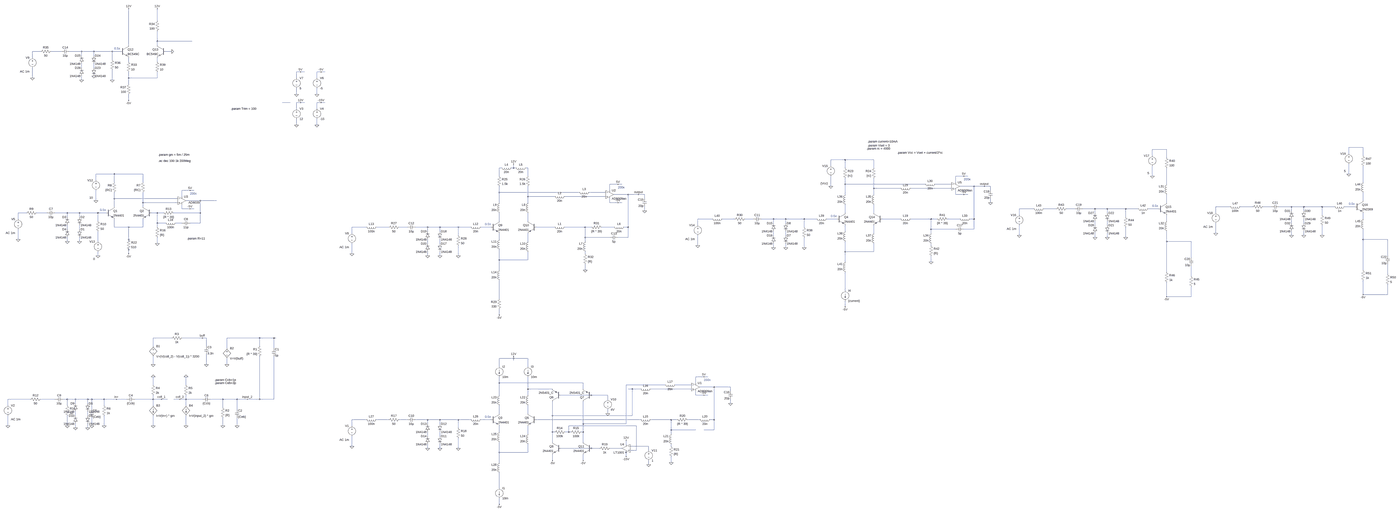
[diagram p0: schematic 202_bandwidth_sim.asc, whole sheet]
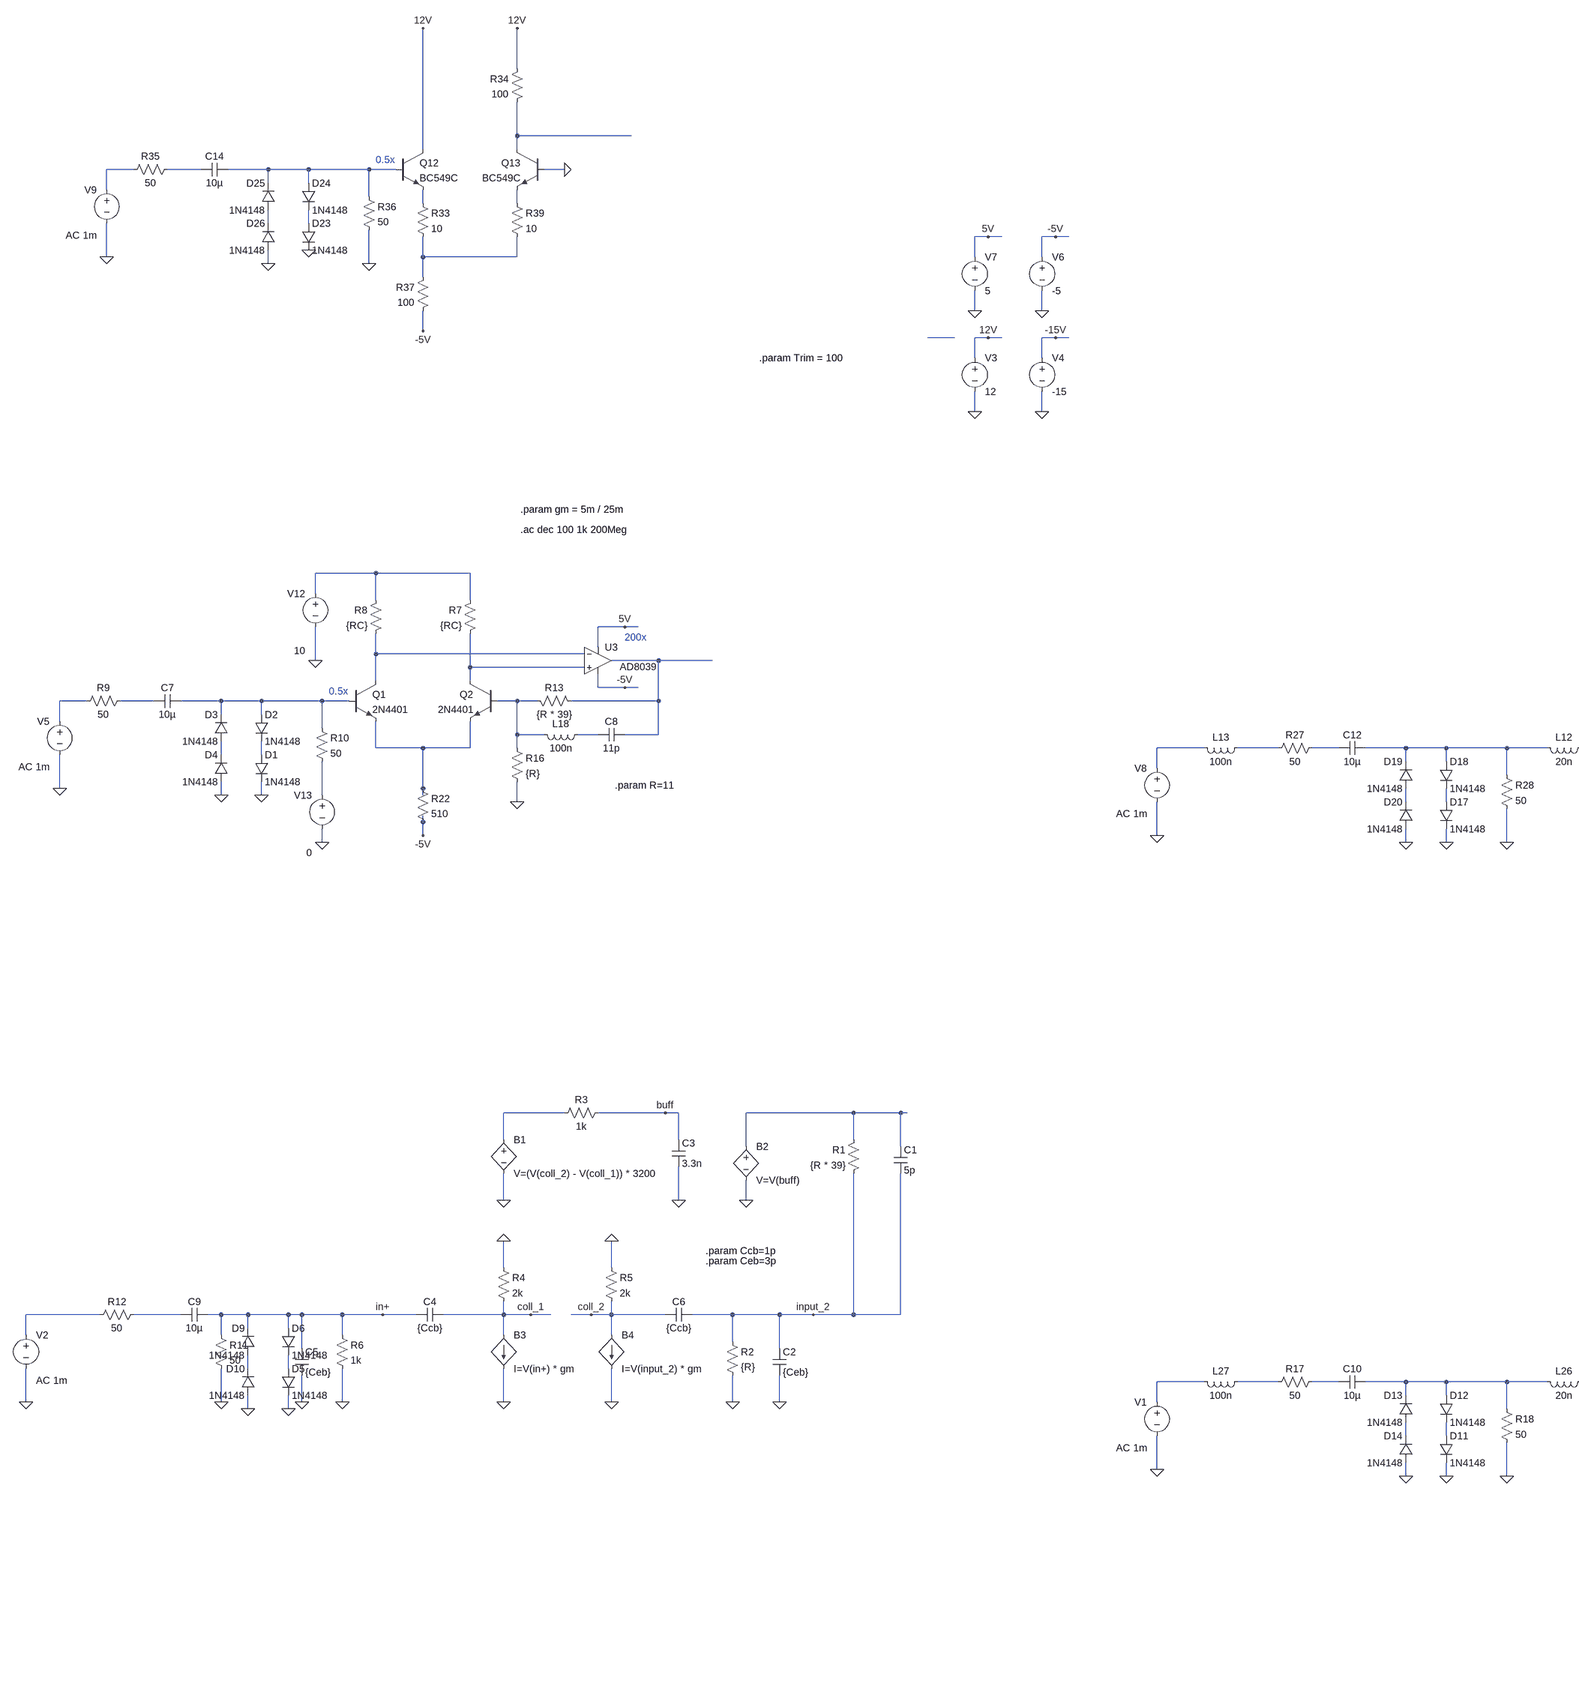
[diagram p1: schematic 202_bandwidth_sim.asc, part, row 1 of 1, column 1 of 3]
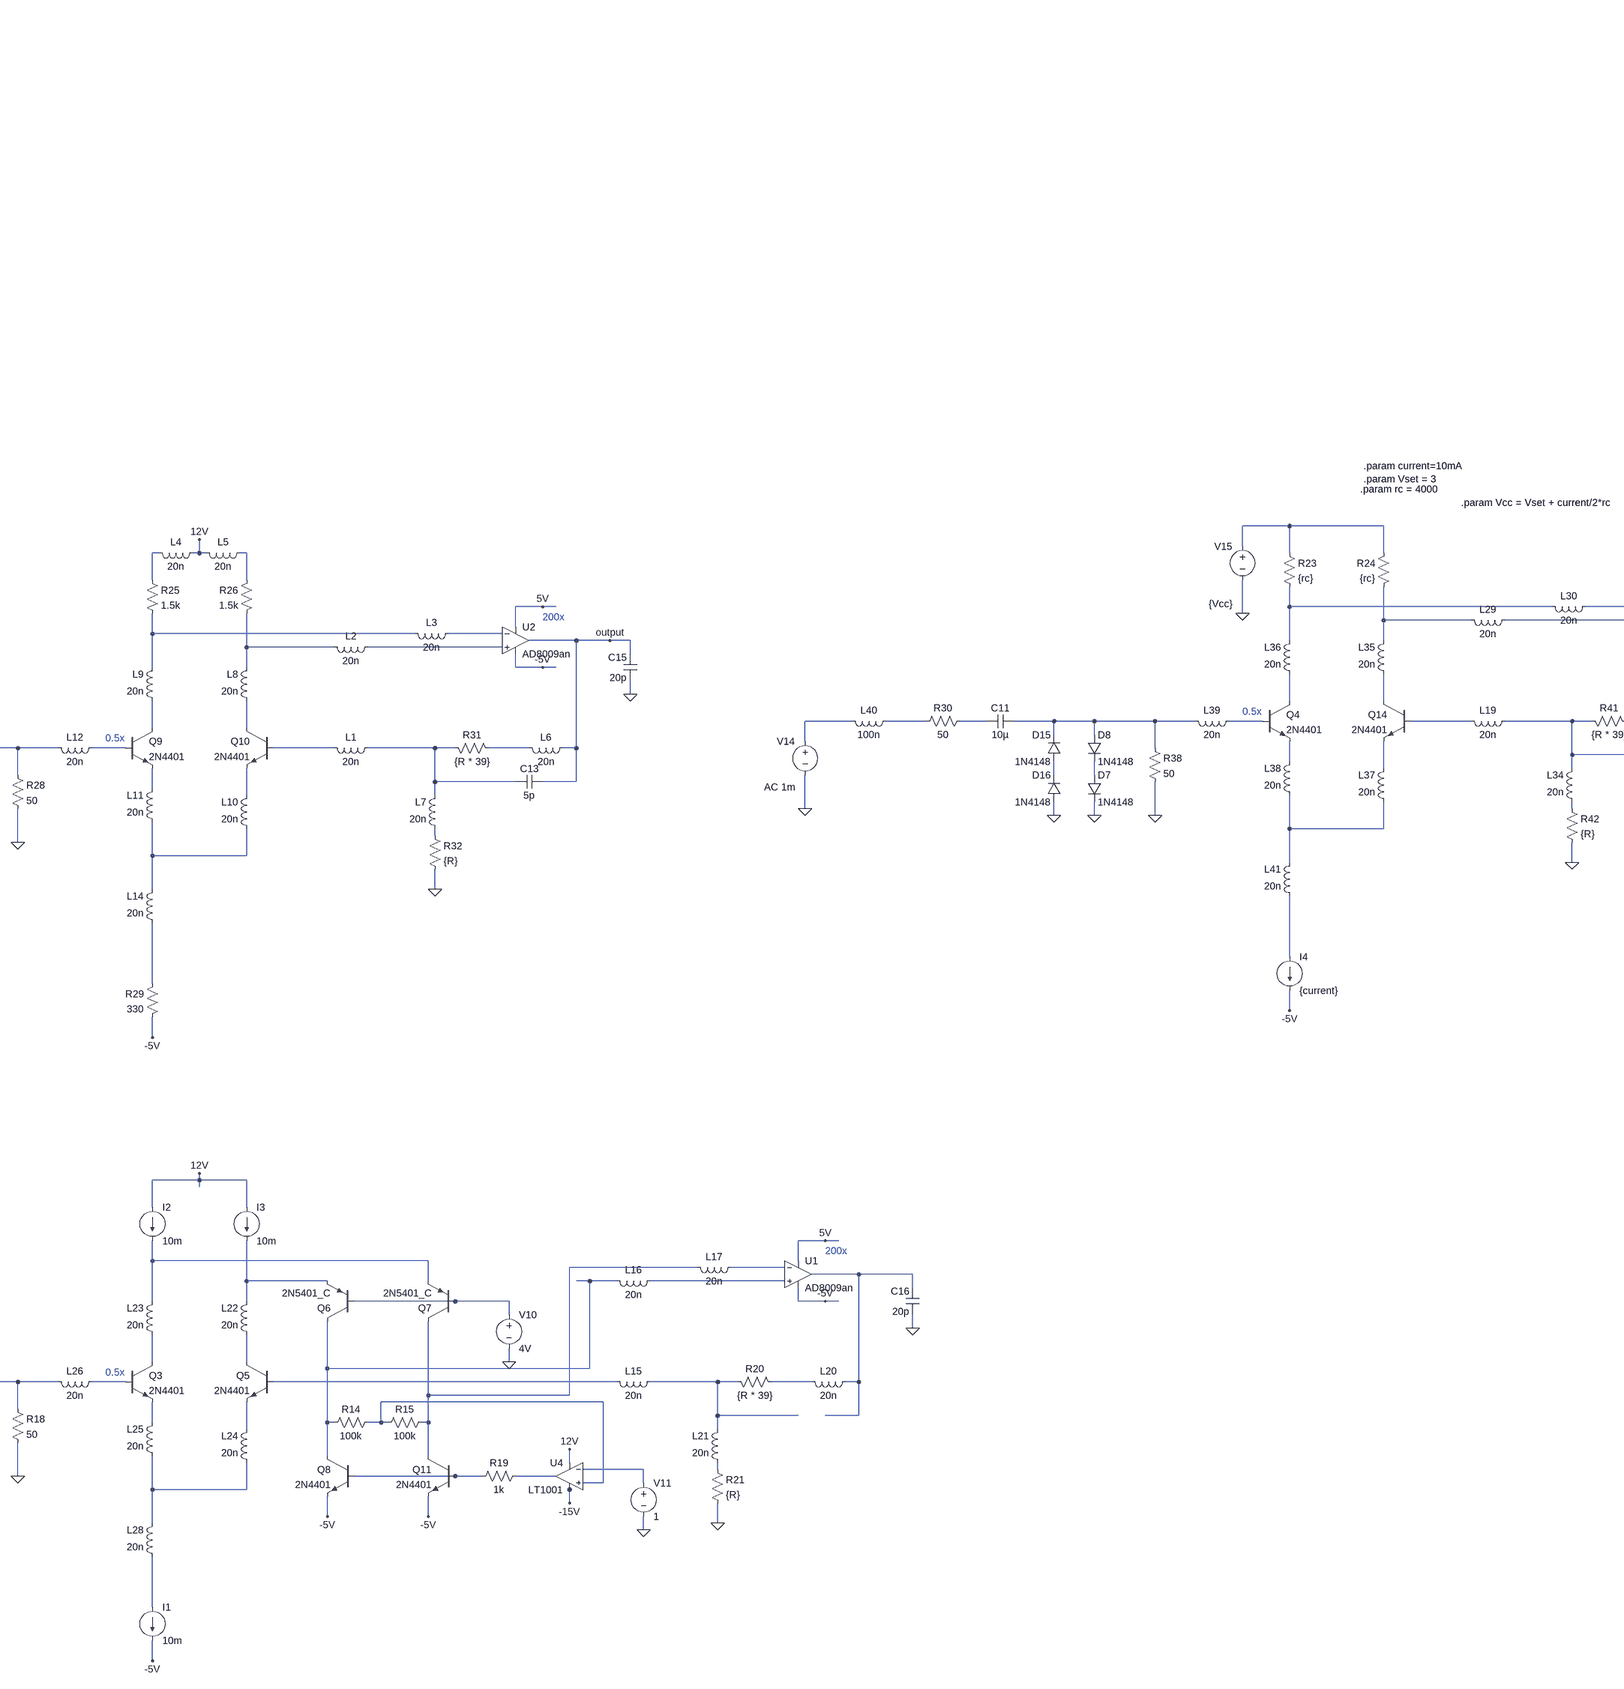
[diagram p2: schematic 202_bandwidth_sim.asc, part, row 1 of 1, column 2 of 3]
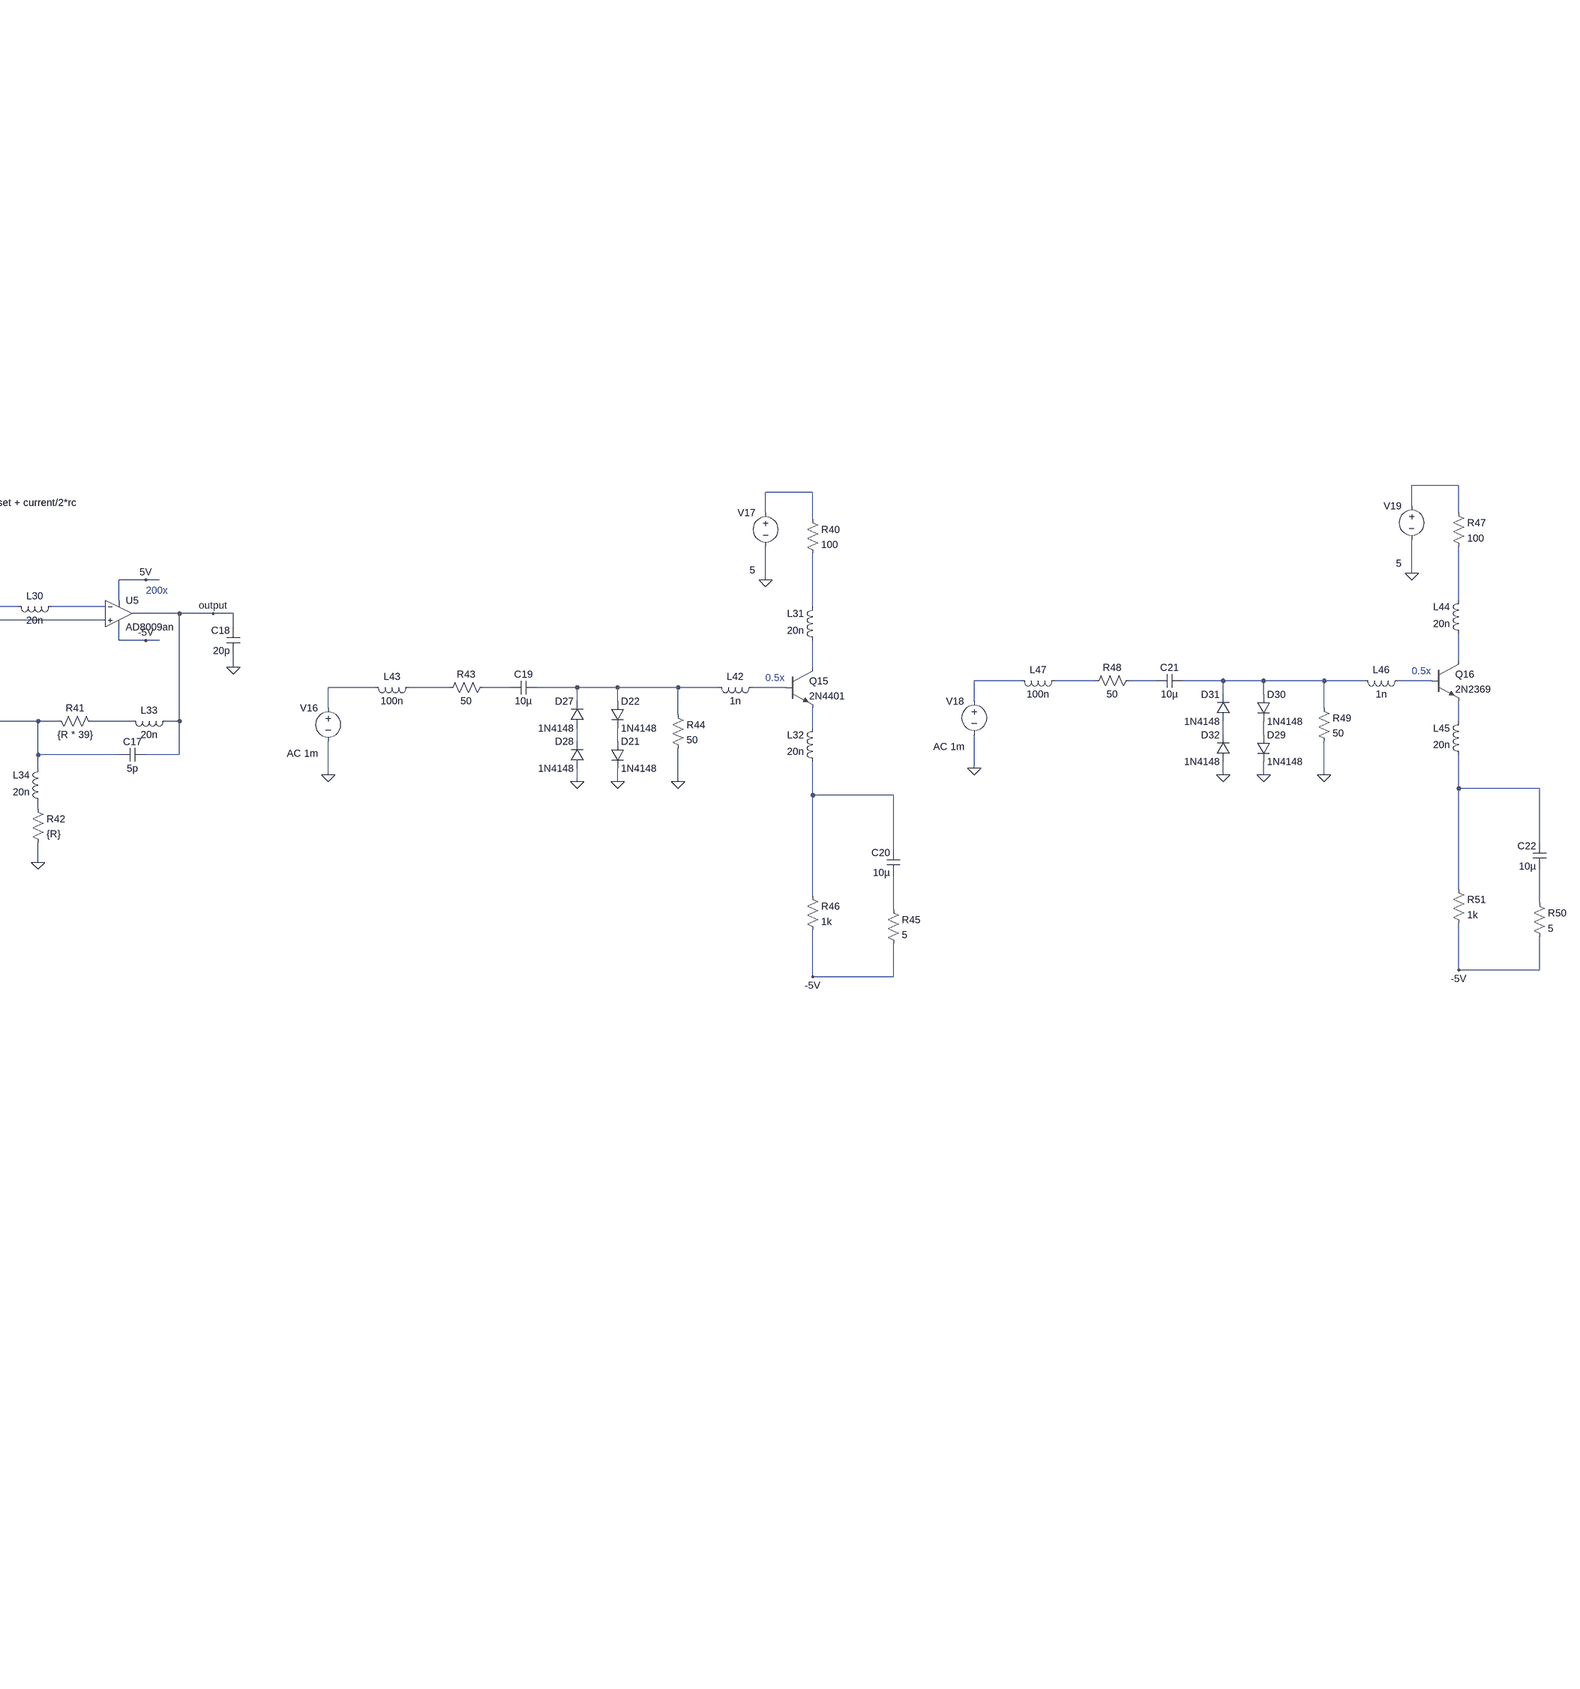
[diagram p3: schematic 202_bandwidth_sim.asc, part, row 1 of 1, column 3 of 3]
202_bandwidth_sim.asc, the LTspice schematic file:
Version 4
SHEET 1 5092 2452
WIRE -6144 -1472 -6144 -1568
WIRE -6144 -1312 -6144 -1392
WIRE -5872 -1312 -6144 -1312
WIRE -6368 -1280 -6368 -1568
WIRE -6144 -1280 -6144 -1312
WIRE -7056 -1232 -7120 -1232
WIRE -6896 -1232 -6976 -1232
WIRE -6736 -1232 -6832 -1232
WIRE -6640 -1232 -6736 -1232
WIRE -6496 -1232 -6640 -1232
WIRE -6432 -1232 -6496 -1232
WIRE -6032 -1232 -6080 -1232
WIRE -6736 -1200 -6736 -1232
WIRE -6640 -1200 -6640 -1232
WIRE -7120 -1184 -7120 -1232
WIRE -6496 -1168 -6496 -1232
WIRE -6368 -1152 -6368 -1184
WIRE -6144 -1152 -6144 -1184
WIRE -6736 -1104 -6736 -1136
WIRE -6640 -1104 -6640 -1136
WIRE -5024 -1072 -5056 -1072
WIRE -4992 -1072 -5024 -1072
WIRE -4864 -1072 -4896 -1072
WIRE -4832 -1072 -4864 -1072
WIRE -7120 -1024 -7120 -1104
WIRE -6368 -1024 -6368 -1072
WIRE -6144 -1024 -6144 -1072
WIRE -6144 -1024 -6368 -1024
WIRE -5056 -1024 -5056 -1072
WIRE -4896 -1024 -4896 -1072
WIRE -6736 -1008 -6736 -1040
WIRE -6496 -1008 -6496 -1088
WIRE -6368 -976 -6368 -1024
WIRE -5056 -896 -5056 -944
WIRE -4896 -896 -4896 -944
WIRE -6368 -848 -6368 -896
WIRE -5104 -832 -5168 -832
WIRE -5024 -832 -5056 -832
WIRE -4992 -832 -5024 -832
WIRE -4864 -832 -4896 -832
WIRE -4832 -832 -4864 -832
WIRE -5056 -784 -5056 -832
WIRE -4896 -784 -4896 -832
WIRE -5056 -656 -5056 -704
WIRE -4896 -656 -4896 -704
WIRE 4832 -480 4720 -480
WIRE 3296 -464 3184 -464
WIRE 4720 -432 4720 -480
WIRE 3184 -416 3184 -464
WIRE 4832 -416 4832 -480
WIRE 3296 -400 3296 -464
WIRE 656 -384 544 -384
WIRE 880 -384 656 -384
WIRE 544 -336 544 -384
WIRE -2032 -320 -2048 -320
WIRE -1936 -320 -1936 -352
WIRE -1936 -320 -1952 -320
WIRE -1920 -320 -1936 -320
WIRE -1824 -320 -1840 -320
WIRE 656 -320 656 -384
WIRE 880 -320 880 -384
WIRE -6480 -272 -6624 -272
WIRE -6256 -272 -6480 -272
WIRE 4720 -272 4720 -352
WIRE -2048 -256 -2048 -320
WIRE -1824 -256 -1824 -320
WIRE 1584 -256 1520 -256
WIRE 1616 -256 1584 -256
WIRE 3184 -256 3184 -336
WIRE -6624 -224 -6624 -272
WIRE -6480 -208 -6480 -272
WIRE -6256 -208 -6256 -272
WIRE 1520 -208 1520 -256
WIRE 4832 -208 4832 -336
WIRE -1120 -192 -1184 -192
WIRE -1088 -192 -1120 -192
WIRE 656 -192 656 -240
WIRE 1280 -192 656 -192
WIRE 1488 -192 1360 -192
WIRE 3296 -192 3296 -320
WIRE 544 -176 544 -256
WIRE 1664 -176 1552 -176
WIRE 1744 -176 1664 -176
WIRE 1792 -176 1744 -176
WIRE 880 -160 880 -240
WIRE 1088 -160 880 -160
WIRE 1488 -160 1168 -160
WIRE -5888 -144 -5952 -144
WIRE -5856 -144 -5888 -144
WIRE -1184 -144 -1184 -192
WIRE 1792 -144 1792 -176
WIRE -2048 -128 -2048 -176
WIRE -1424 -128 -2048 -128
WIRE -1216 -128 -1344 -128
WIRE -1040 -112 -1152 -112
WIRE -960 -112 -1040 -112
WIRE -912 -112 -960 -112
WIRE 656 -112 656 -192
WIRE 880 -112 880 -160
WIRE 1520 -112 1520 -144
WIRE 1584 -112 1520 -112
WIRE 1616 -112 1584 -112
WIRE -5952 -96 -5952 -144
WIRE -1824 -96 -1824 -176
WIRE -1616 -96 -1824 -96
WIRE -1216 -96 -1536 -96
WIRE -6480 -80 -6480 -128
WIRE -5984 -80 -6480 -80
WIRE -912 -80 -912 -112
WIRE -6624 -64 -6624 -144
WIRE -5808 -64 -5920 -64
WIRE -5680 -64 -5808 -64
WIRE 4832 -64 4832 -128
WIRE -6256 -48 -6256 -128
WIRE -5984 -48 -6256 -48
WIRE -2048 -48 -2048 -128
WIRE -1824 -48 -1824 -96
WIRE -1184 -48 -1184 -80
WIRE -1120 -48 -1184 -48
WIRE -1088 -48 -1120 -48
WIRE 1792 -48 1792 -80
WIRE 3296 -48 3296 -112
WIRE -6480 -16 -6480 -80
WIRE -6256 -16 -6256 -48
WIRE 3792 -16 3680 -16
WIRE 3968 -16 3872 -16
WIRE 4112 -16 4048 -16
WIRE 4272 -16 4176 -16
WIRE 4368 -16 4272 -16
WIRE 4512 -16 4368 -16
WIRE 4608 -16 4512 -16
WIRE 4768 -16 4688 -16
WIRE -5952 0 -5952 -32
WIRE -5888 0 -5952 0
WIRE -5856 0 -5888 0
WIRE 2256 0 2144 0
WIRE 2432 0 2336 0
WIRE 2576 0 2512 0
WIRE 2736 0 2640 0
WIRE 2832 0 2736 0
WIRE 2976 0 2832 0
WIRE 3072 0 2976 0
WIRE 3232 0 3152 0
WIRE -912 16 -912 -16
WIRE 4272 16 4272 -16
WIRE 4368 16 4368 -16
WIRE -7168 32 -7232 32
WIRE -7008 32 -7088 32
WIRE -6848 32 -6944 32
WIRE -6752 32 -6848 32
WIRE -6608 32 -6752 32
WIRE -6544 32 -6608 32
WIRE -6144 32 -6192 32
WIRE -6096 32 -6144 32
WIRE -5808 32 -5808 -64
WIRE -5808 32 -6016 32
WIRE 656 32 656 -32
WIRE 880 32 880 -32
WIRE 2736 32 2736 0
WIRE 2832 32 2832 0
WIRE 3680 32 3680 -16
WIRE 2144 48 2144 0
WIRE 4512 48 4512 -16
WIRE -6848 64 -6848 32
WIRE -6752 64 -6752 32
WIRE 2976 64 2976 0
WIRE -7232 80 -7232 32
WIRE -384 80 -496 80
WIRE -208 80 -304 80
WIRE -64 80 -128 80
WIRE 96 80 0 80
WIRE 192 80 96 80
WIRE 336 80 192 80
WIRE 432 80 336 80
WIRE 592 80 512 80
WIRE 1088 80 944 80
WIRE 1328 80 1168 80
WIRE 1376 80 1328 80
WIRE 1552 80 1456 80
WIRE 1664 80 1664 -176
WIRE 1664 80 1632 80
WIRE 4832 80 4832 32
WIRE -6608 96 -6608 32
WIRE -2048 96 -2048 32
WIRE -1824 96 -1824 32
WIRE 3296 96 3296 48
WIRE -6144 112 -6144 32
WIRE -6080 112 -6144 112
WIRE -5952 112 -6000 112
WIRE -5808 112 -5808 32
WIRE -5808 112 -5888 112
WIRE 96 112 96 80
WIRE 192 112 192 80
WIRE 4272 112 4272 80
WIRE 4368 112 4368 80
WIRE -496 128 -496 80
WIRE 2736 128 2736 96
WIRE 2832 128 2832 96
WIRE -6480 144 -6480 80
WIRE -6368 144 -6480 144
WIRE -6256 144 -6256 80
WIRE -6256 144 -6368 144
WIRE -6144 144 -6144 112
WIRE -3088 144 -3200 144
WIRE -2912 144 -3008 144
WIRE -2768 144 -2832 144
WIRE -2608 144 -2704 144
WIRE -2512 144 -2608 144
WIRE -2368 144 -2512 144
WIRE -2272 144 -2368 144
WIRE -2112 144 -2192 144
WIRE -1616 144 -1760 144
WIRE -1376 144 -1536 144
WIRE -1328 144 -1376 144
WIRE -1152 144 -1248 144
WIRE -1040 144 -1040 -112
WIRE -1040 144 -1072 144
WIRE 336 144 336 80
WIRE -6848 160 -6848 128
WIRE -6752 160 -6752 128
WIRE 1328 160 1328 80
WIRE 1520 160 1328 160
WIRE 1664 160 1664 80
WIRE 1664 160 1584 160
WIRE -2608 176 -2608 144
WIRE -2512 176 -2512 144
WIRE 656 176 656 128
WIRE -3200 192 -3200 144
WIRE 880 192 880 128
WIRE 1328 192 1328 160
WIRE 3680 192 3680 112
WIRE -2368 208 -2368 144
WIRE 96 208 96 176
WIRE 192 208 192 176
WIRE 2144 208 2144 128
WIRE 4272 208 4272 176
WIRE 4368 208 4368 176
WIRE 4512 208 4512 128
WIRE -1376 224 -1376 144
WIRE -1184 224 -1376 224
WIRE -1040 224 -1040 144
WIRE -1040 224 -1120 224
WIRE 2736 224 2736 192
WIRE 2832 224 2832 192
WIRE 2976 224 2976 144
WIRE -7232 240 -7232 160
WIRE -6368 240 -6368 144
WIRE -2048 240 -2048 192
WIRE 4832 240 4832 160
WIRE 5024 240 4832 240
WIRE -6848 256 -6848 224
WIRE -6752 256 -6752 224
WIRE -6608 256 -6608 176
WIRE -6368 256 -6368 240
WIRE -1824 256 -1824 192
WIRE -1376 256 -1376 224
WIRE 3296 256 3296 176
WIRE 3488 256 3296 256
WIRE -6144 272 -6144 224
WIRE -2608 272 -2608 240
WIRE -2512 272 -2512 240
WIRE -496 288 -496 208
WIRE 1328 288 1328 272
WIRE 96 304 96 272
WIRE 192 304 192 272
WIRE 336 304 336 224
WIRE -6368 320 -6368 304
WIRE 656 336 656 256
WIRE 880 336 880 272
WIRE 880 336 656 336
WIRE -6368 352 -6368 320
WIRE -3200 352 -3200 272
WIRE -1376 352 -1376 336
WIRE -6608 368 -6608 336
WIRE -2608 368 -2608 336
WIRE -2512 368 -2512 336
WIRE -2368 368 -2368 288
WIRE 5024 368 5024 240
WIRE 3488 384 3488 256
WIRE -2048 400 -2048 320
WIRE -1824 400 -1824 336
WIRE -1824 400 -2048 400
WIRE 656 416 656 336
WIRE 1328 416 1328 368
WIRE -2048 480 -2048 400
WIRE -1376 480 -1376 432
WIRE 4832 480 4832 240
WIRE 3296 496 3296 256
WIRE 5024 512 5024 432
WIRE 3488 528 3488 448
WIRE 656 640 656 496
WIRE 4832 672 4832 560
WIRE 5024 672 5024 592
WIRE 5024 672 4832 672
WIRE 3296 688 3296 576
WIRE 3488 688 3488 608
WIRE 3488 688 3296 688
WIRE -2048 704 -2048 560
WIRE 656 768 656 720
WIRE -2048 832 -2048 784
WIRE -6032 1040 -6176 1040
WIRE -5792 1040 -5952 1040
WIRE -5760 1040 -5792 1040
WIRE -5344 1040 -5600 1040
WIRE -5232 1040 -5344 1040
WIRE -5216 1040 -5232 1040
WIRE -6176 1104 -6176 1040
WIRE -5760 1104 -5760 1040
WIRE -5344 1104 -5344 1040
WIRE -5600 1120 -5600 1040
WIRE -5232 1120 -5232 1040
WIRE -1936 1200 -1936 1184
WIRE -1936 1200 -2048 1200
WIRE -1824 1200 -1936 1200
WIRE -1936 1216 -1936 1200
WIRE -6176 1248 -6176 1184
WIRE -6176 1248 -6192 1248
WIRE -5760 1248 -5760 1168
WIRE -5600 1248 -5600 1200
WIRE -5600 1248 -5616 1248
WIRE -2048 1264 -2048 1200
WIRE -1824 1264 -1824 1200
WIRE -448 1344 -512 1344
WIRE -416 1344 -448 1344
WIRE -2048 1392 -2048 1344
WIRE -1392 1392 -2048 1392
WIRE -512 1392 -512 1344
WIRE -6176 1408 -6176 1344
WIRE -5920 1408 -5920 1344
WIRE -752 1408 -1056 1408
WIRE -544 1408 -672 1408
WIRE -368 1424 -480 1424
WIRE -240 1424 -368 1424
WIRE -1824 1440 -1824 1344
WIRE -1632 1440 -1824 1440
WIRE -1392 1440 -1392 1392
WIRE -1008 1440 -1040 1440
WIRE -944 1440 -1008 1440
WIRE -544 1440 -864 1440
WIRE -240 1456 -240 1424
WIRE -2048 1488 -2048 1392
WIRE -1824 1488 -1824 1440
WIRE -1328 1488 -1568 1488
WIRE -1200 1488 -1328 1488
WIRE -512 1488 -512 1456
WIRE -448 1488 -512 1488
WIRE -416 1488 -448 1488
WIRE -7136 1520 -7312 1520
WIRE -6944 1520 -7056 1520
WIRE -6848 1520 -6880 1520
WIRE -6784 1520 -6848 1520
WIRE -6688 1520 -6784 1520
WIRE -6656 1520 -6688 1520
WIRE -6560 1520 -6656 1520
WIRE -6464 1520 -6560 1520
WIRE -6384 1520 -6464 1520
WIRE -6176 1520 -6176 1488
WIRE -6176 1520 -6320 1520
WIRE -6112 1520 -6176 1520
WIRE -6064 1520 -6112 1520
WIRE -5968 1520 -6016 1520
WIRE -5920 1520 -5920 1488
WIRE -5920 1520 -5968 1520
WIRE -5792 1520 -5920 1520
WIRE -5632 1520 -5728 1520
WIRE -5520 1520 -5632 1520
WIRE -5440 1520 -5520 1520
WIRE -5344 1520 -5344 1184
WIRE -5344 1520 -5440 1520
WIRE -5232 1520 -5232 1184
WIRE -5232 1520 -5344 1520
WIRE -1200 1520 -1200 1488
WIRE -6784 1552 -6784 1520
WIRE -6688 1552 -6688 1520
WIRE -240 1552 -240 1520
WIRE -7312 1568 -7312 1520
WIRE -6848 1568 -6848 1520
WIRE -6560 1568 -6560 1520
WIRE -6176 1568 -6176 1520
WIRE -5920 1568 -5920 1520
WIRE -5632 1584 -5632 1520
WIRE -6656 1600 -6656 1520
WIRE -5520 1600 -5520 1520
WIRE -2048 1632 -2048 1568
WIRE -1824 1632 -1824 1568
WIRE -1200 1632 -1200 1600
WIRE -6784 1648 -6784 1616
WIRE -6688 1648 -6688 1616
WIRE -1632 1648 -1632 1536
WIRE -1008 1648 -1008 1440
WIRE -1008 1648 -1632 1648
WIRE -3088 1680 -3200 1680
WIRE -2912 1680 -3008 1680
WIRE -2768 1680 -2832 1680
WIRE -2608 1680 -2704 1680
WIRE -2512 1680 -2608 1680
WIRE -2368 1680 -2512 1680
WIRE -2272 1680 -2368 1680
WIRE -2112 1680 -2192 1680
WIRE -944 1680 -1760 1680
WIRE -704 1680 -864 1680
WIRE -656 1680 -704 1680
WIRE -480 1680 -576 1680
WIRE -368 1680 -368 1424
WIRE -368 1680 -400 1680
WIRE -2608 1712 -2608 1680
WIRE -2512 1712 -2512 1680
WIRE -1392 1712 -1392 1536
WIRE -1056 1712 -1056 1408
WIRE -1056 1712 -1392 1712
WIRE -7312 1728 -7312 1648
WIRE -6848 1728 -6848 1648
WIRE -6656 1728 -6656 1664
WIRE -6560 1728 -6560 1648
WIRE -6176 1728 -6176 1648
WIRE -5920 1728 -5920 1648
WIRE -5632 1728 -5632 1664
WIRE -5520 1728 -5520 1664
WIRE -3200 1728 -3200 1680
WIRE -976 1728 -1504 1728
WIRE -6784 1744 -6784 1712
WIRE -6688 1744 -6688 1712
WIRE -2368 1744 -2368 1680
WIRE -704 1760 -704 1680
WIRE -512 1760 -704 1760
WIRE -368 1760 -368 1680
WIRE -368 1760 -448 1760
WIRE -2048 1776 -2048 1728
WIRE -1632 1776 -1632 1648
WIRE -1616 1776 -1632 1776
WIRE -1504 1776 -1504 1728
WIRE -1504 1776 -1536 1776
WIRE -1488 1776 -1504 1776
WIRE -1392 1776 -1392 1712
WIRE -1392 1776 -1408 1776
WIRE -1824 1792 -1824 1728
WIRE -704 1792 -704 1760
WIRE -2608 1808 -2608 1776
WIRE -2512 1808 -2512 1776
WIRE -1632 1856 -1632 1776
WIRE -1392 1856 -1392 1776
WIRE -1056 1872 -1056 1840
WIRE -3200 1888 -3200 1808
WIRE -880 1888 -1024 1888
WIRE -704 1888 -704 1872
WIRE -2608 1904 -2608 1872
WIRE -2512 1904 -2512 1872
WIRE -2368 1904 -2368 1824
WIRE -1328 1904 -1568 1904
WIRE -1264 1904 -1328 1904
WIRE -1088 1904 -1184 1904
WIRE -976 1920 -976 1728
WIRE -976 1920 -1024 1920
WIRE -880 1920 -880 1888
WIRE -2048 1936 -2048 1856
WIRE -1824 1936 -1824 1872
WIRE -1824 1936 -2048 1936
WIRE -1056 1936 -1056 1920
WIRE -1056 1968 -1056 1936
WIRE -1632 2000 -1632 1952
WIRE -1392 2000 -1392 1952
WIRE -2048 2016 -2048 1936
WIRE -704 2016 -704 1968
WIRE -880 2032 -880 2000
WIRE -2048 2240 -2048 2096
WIRE -2048 2368 -2048 2320
FLAG -5632 1728 0
FLAG -5520 1728 0
FLAG -6176 1248 0
FLAG -5760 1248 0
FLAG -5600 1248 0
FLAG -5792 1040 buff
FLAG -5440 1520 input_2
FLAG -6176 1728 0
FLAG -6176 1344 0
FLAG -7312 1728 0
FLAG -6464 1520 in+
FLAG -5920 1728 0
FLAG -5920 1344 0
FLAG -5968 1520 coll_2
FLAG -6112 1520 coll_1
FLAG -6656 1728 0
FLAG -6560 1728 0
FLAG -5024 -832 12V
FLAG -4864 -832 -15V
FLAG -4896 -656 0
FLAG -5056 -656 0
FLAG -6608 368 0
FLAG -5024 -1072 5V
FLAG -4864 -1072 -5V
FLAG -4896 -896 0
FLAG -5056 -896 0
FLAG -5888 -144 5V
FLAG -5888 0 -5V
FLAG -7232 240 0
FLAG -6752 256 0
FLAG -6848 256 0
FLAG -6144 272 0
FLAG -6368 352 -5V
FLAG -6848 1728 0
FLAG -6688 1744 0
FLAG -6784 1744 0
FLAG -1936 -352 12V
FLAG -2368 368 0
FLAG -1120 -192 5V
FLAG -1120 -48 -5V
FLAG -3200 352 0
FLAG -2512 368 0
FLAG -2608 368 0
FLAG -1376 480 0
FLAG -2048 832 -5V
FLAG -912 16 0
FLAG -6144 -1568 12V
FLAG -7120 -1024 0
FLAG -6736 -1008 0
FLAG -6368 -848 -5V
FLAG -6032 -1232 0
FLAG -960 -112 output
FLAG -1936 1184 12V
FLAG -2368 1904 0
FLAG -448 1344 5V
FLAG -448 1488 -5V
FLAG -3200 1888 0
FLAG -2512 1904 0
FLAG -2608 1904 0
FLAG -704 2016 0
FLAG -2048 2368 -5V
FLAG -240 1552 0
FLAG -1200 1632 0
FLAG -1632 2000 -5V
FLAG -1392 2000 -5V
FLAG -1056 1968 -15V
FLAG -1056 1840 12V
FLAG -880 2032 0
FLAG -6368 -1568 12V
FLAG -6496 -1008 0
FLAG -6640 -1040 0
FLAG -6624 -64 0
FLAG 336 304 0
FLAG 1584 -256 5V
FLAG 1584 -112 -5V
FLAG -496 288 0
FLAG 192 304 0
FLAG 96 304 0
FLAG 1328 416 0
FLAG 656 768 -5V
FLAG 1792 -48 0
FLAG 1744 -176 output
FLAG 544 -176 0
FLAG 2976 224 0
FLAG 2144 208 0
FLAG 2832 224 0
FLAG 2736 224 0
FLAG 3296 688 -5V
FLAG 3184 -256 0
FLAG 4512 208 0
FLAG 3680 192 0
FLAG 4368 208 0
FLAG 4272 208 0
FLAG 4832 672 -5V
FLAG 4720 -272 0
SYMBOL res -5328 1088 M0
SYMATTR InstName R1
SYMATTR Value {R * 39}
SYMBOL res -5648 1568 R0
SYMATTR InstName R2
SYMATTR Value {R}
SYMBOL cap -5248 1120 R0
SYMATTR InstName C1
SYMATTR Value 5p
SYMBOL cap -5536 1600 R0
SYMATTR InstName C2
SYMATTR Value {Ceb}
SYMBOL bv -6176 1088 R0
SYMATTR InstName B1
SYMATTR Value V=(V(coll_2) - V(coll_1)) * 3200
SYMBOL res -5936 1024 R90
WINDOW 0 0 56 VBottom 2
WINDOW 3 32 56 VTop 2
SYMATTR InstName R3
SYMATTR Value 1k
SYMBOL cap -5776 1104 R0
SYMATTR InstName C3
SYMATTR Value 3.3n
SYMBOL bv -5600 1104 R0
SYMATTR InstName B2
SYMATTR Value V=V(buff)
SYMBOL bi -6176 1568 R0
SYMATTR InstName B3
SYMATTR Value I=V(in+) * gm
SYMBOL res -6192 1392 R0
SYMATTR InstName R4
SYMATTR Value 2k
SYMBOL voltage -7312 1552 R0
WINDOW 123 24 124 Left 2
WINDOW 39 0 0 Left 0
SYMATTR Value2 AC 1m
SYMATTR InstName V2
SYMATTR Value ""
SYMBOL bi -5920 1568 R0
SYMATTR InstName B4
SYMATTR Value I=V(input_2) * gm
SYMBOL res -5936 1392 R0
SYMATTR InstName R5
SYMATTR Value 2k
SYMBOL res -6576 1552 R0
SYMATTR InstName R6
SYMATTR Value 1k
SYMBOL cap -5728 1504 R90
WINDOW 0 0 32 VBottom 2
WINDOW 3 32 32 VTop 2
SYMATTR InstName C6
SYMATTR Value {Ccb}
SYMBOL voltage -5056 -800 R0
WINDOW 123 0 0 Left 0
WINDOW 39 0 0 Left 0
SYMATTR InstName V3
SYMATTR Value 12
SYMBOL voltage -4896 -800 R0
WINDOW 123 0 0 Left 0
WINDOW 39 0 0 Left 0
SYMATTR InstName V4
SYMATTR Value -15
SYMBOL voltage -7232 64 M0
WINDOW 123 24 124 Left 2
WINDOW 39 0 0 Left 0
SYMATTR Value2 AC 1m
SYMATTR InstName V5
SYMATTR Value ""
SYMBOL res -6464 -224 M0
SYMATTR InstName R8
SYMATTR Value {RC}
SYMBOL cap -6944 16 R90
WINDOW 0 0 32 VBottom 2
WINDOW 3 32 32 VTop 2
SYMATTR InstName C7
SYMATTR Value 10µ
SYMBOL res -7072 16 R90
WINDOW 0 0 56 VBottom 2
WINDOW 3 32 56 VTop 2
SYMATTR InstName R9
SYMATTR Value 50
SYMBOL res -6624 80 R0
SYMATTR InstName R10
SYMATTR Value 50
SYMBOL cap -5888 96 R90
WINDOW 0 0 32 VBottom 2
WINDOW 3 32 32 VTop 2
SYMATTR InstName C8
SYMATTR Value 11p
SYMBOL npn -6544 -16 R0
SYMATTR InstName Q1
SYMATTR Value 2N4401
SYMBOL npn -6192 -16 M0
SYMATTR InstName Q2
SYMATTR Value 2N4401
SYMBOL voltage -4896 -1040 R0
WINDOW 123 0 0 Left 0
WINDOW 39 0 0 Left 0
SYMATTR InstName V6
SYMATTR Value -5
SYMBOL voltage -5056 -1040 R0
WINDOW 123 0 0 Left 0
WINDOW 39 0 0 Left 0
SYMATTR InstName V7
SYMATTR Value 5
SYMBOL diode -6768 160 R0
SYMATTR InstName D1
SYMATTR Value 1N4148
SYMBOL diode -6768 64 R0
SYMATTR InstName D2
SYMATTR Value 1N4148
SYMBOL diode -6832 128 R180
WINDOW 0 24 64 Left 2
WINDOW 3 24 0 Left 2
SYMATTR InstName D3
SYMATTR Value 1N4148
SYMBOL diode -6832 224 R180
WINDOW 0 24 64 Left 2
WINDOW 3 24 0 Left 2
SYMATTR InstName D4
SYMATTR Value 1N4148
SYMBOL OpAmps\\AD8039 -5952 -128 R0
WINDOW 3 52 78 Left 2
SYMATTR InstName U3
SYMBOL cap -6880 1504 R90
WINDOW 0 0 32 VBottom 2
WINDOW 3 32 32 VTop 2
SYMATTR InstName C9
SYMATTR Value 10µ
SYMBOL res -6864 1552 R0
SYMATTR InstName R11
SYMATTR Value 50
SYMBOL res -7040 1504 R90
WINDOW 0 0 56 VBottom 2
WINDOW 3 32 56 VTop 2
SYMATTR InstName R12
SYMATTR Value 50
SYMBOL cap -6320 1504 R90
WINDOW 0 0 32 VBottom 2
WINDOW 3 32 32 VTop 2
SYMATTR InstName C4
SYMATTR Value {Ccb}
SYMBOL cap -6672 1600 R0
SYMATTR InstName C5
SYMATTR Value {Ceb}
SYMBOL diode -6704 1648 R0
SYMATTR InstName D5
SYMATTR Value 1N4148
SYMBOL diode -6704 1552 R0
SYMATTR InstName D6
SYMATTR Value 1N4148
SYMBOL diode -6768 1616 R180
WINDOW 0 24 64 Left 2
WINDOW 3 24 0 Left 2
SYMATTR InstName D9
SYMATTR Value 1N4148
SYMBOL diode -6768 1712 R180
WINDOW 0 24 64 Left 2
WINDOW 3 24 0 Left 2
SYMATTR InstName D10
SYMATTR Value 1N4148
SYMBOL res -6000 48 M270
WINDOW 0 32 56 VTop 2
WINDOW 3 0 56 VBottom 2
SYMATTR InstName R13
SYMATTR Value {R * 39}
SYMBOL res -6160 128 R0
SYMATTR InstName R16
SYMATTR Value {R}
SYMBOL voltage -3200 176 M0
WINDOW 123 24 124 Left 2
WINDOW 39 0 0 Left 0
SYMATTR Value2 AC 1m
SYMATTR InstName V8
SYMATTR Value ""
SYMBOL res -2064 -272 R0
SYMATTR InstName R25
SYMATTR Value 1.5k
SYMBOL res -1808 -272 M0
SYMATTR InstName R26
SYMATTR Value 1.5k
SYMBOL cap -2704 128 R90
WINDOW 0 0 32 VBottom 2
WINDOW 3 32 32 VTop 2
SYMATTR InstName C12
SYMATTR Value 10µ
SYMBOL res -2816 128 R90
WINDOW 0 0 56 VBottom 2
WINDOW 3 32 56 VTop 2
SYMATTR InstName R27
SYMATTR Value 50
SYMBOL res -2384 192 R0
SYMATTR InstName R28
SYMATTR Value 50
SYMBOL npn -2112 96 R0
SYMATTR InstName Q9
SYMATTR Value 2N4401
SYMBOL npn -1760 96 M0
SYMATTR InstName Q10
SYMATTR Value 2N4401
SYMBOL diode -2528 272 R0
SYMATTR InstName D17
SYMATTR Value 1N4148
SYMBOL diode -2528 176 R0
SYMATTR InstName D18
SYMATTR Value 1N4148
SYMBOL diode -2592 240 R180
WINDOW 0 24 64 Left 2
WINDOW 3 24 0 Left 2
SYMATTR InstName D19
SYMATTR Value 1N4148
SYMBOL diode -2592 336 R180
WINDOW 0 24 64 Left 2
WINDOW 3 24 0 Left 2
SYMATTR InstName D20
SYMATTR Value 1N4148
SYMBOL res -2032 688 M0
SYMATTR InstName R29
SYMATTR Value 330
SYMBOL res -1232 160 M270
WINDOW 0 32 56 VTop 2
WINDOW 3 0 56 VBottom 2
SYMATTR InstName R31
SYMATTR Value {R * 39}
SYMBOL res -1392 336 R0
SYMATTR InstName R32
SYMATTR Value {R}
SYMBOL ZZZ\\OpAmp\\AD8009an -1184 -112 R0
SYMATTR InstName U2
SYMBOL cap -1120 208 R90
WINDOW 0 0 32 VBottom 2
WINDOW 3 32 32 VTop 2
SYMATTR InstName C13
SYMATTR Value 5p
SYMBOL cap -896 -16 R180
WINDOW 0 24 56 Left 2
WINDOW 3 24 8 Left 2
SYMATTR InstName C15
SYMATTR Value 20p
SYMBOL voltage -7120 -1200 M0
WINDOW 123 24 124 Left 2
WINDOW 39 0 0 Left 0
SYMATTR Value2 AC 1m
SYMATTR InstName V9
SYMATTR Value ""
SYMBOL res -6128 -1488 M0
SYMATTR InstName R34
SYMATTR Value 100
SYMBOL cap -6832 -1248 R90
WINDOW 0 0 32 VBottom 2
WINDOW 3 32 32 VTop 2
SYMATTR InstName C14
SYMATTR Value 10µ
SYMBOL res -6960 -1248 R90
WINDOW 0 0 56 VBottom 2
WINDOW 3 32 56 VTop 2
SYMATTR InstName R35
SYMATTR Value 50
SYMBOL res -6512 -1184 R0
SYMATTR InstName R36
SYMATTR Value 50
SYMBOL npn -6432 -1280 R0
SYMATTR InstName Q12
SYMATTR Value BC549C
SYMBOL npn -6080 -1280 M0
SYMATTR InstName Q13
SYMATTR Value BC549C
SYMBOL diode -6656 -1104 R0
SYMATTR InstName D23
SYMATTR Value 1N4148
SYMBOL diode -6656 -1200 R0
SYMATTR InstName D24
SYMATTR Value 1N4148
SYMBOL diode -6720 -1136 R180
WINDOW 0 24 64 Left 2
WINDOW 3 24 0 Left 2
SYMATTR InstName D25
SYMATTR Value 1N4148
SYMBOL diode -6720 -1040 R180
WINDOW 0 24 64 Left 2
WINDOW 3 24 0 Left 2
SYMATTR InstName D26
SYMATTR Value 1N4148
SYMBOL res -6352 -992 M0
SYMATTR InstName R37
SYMATTR Value 100
SYMBOL res -6384 -1168 R0
SYMATTR InstName R33
SYMATTR Value 10
SYMBOL res -6160 -1168 R0
SYMATTR InstName R39
SYMATTR Value 10
SYMBOL ind -1520 128 R90
WINDOW 0 5 56 VBottom 2
WINDOW 3 32 56 VTop 2
SYMATTR InstName L1
SYMATTR Value 20n
SYMBOL ind -1520 -112 R90
WINDOW 0 5 56 VBottom 2
WINDOW 3 32 56 VTop 2
SYMATTR InstName L2
SYMATTR Value 20n
SYMBOL ind -1328 -144 R90
WINDOW 0 5 56 VBottom 2
WINDOW 3 32 56 VTop 2
SYMATTR InstName L3
SYMATTR Value 20n
SYMBOL ind -1936 -336 R90
WINDOW 0 5 56 VBottom 2
WINDOW 3 32 56 VTop 2
SYMATTR InstName L4
SYMATTR Value 20n
SYMBOL ind -1824 -336 R90
WINDOW 0 5 56 VBottom 2
WINDOW 3 32 56 VTop 2
SYMATTR InstName L5
SYMATTR Value 20n
SYMBOL ind -1056 128 R90
WINDOW 0 5 56 VBottom 2
WINDOW 3 32 56 VTop 2
SYMATTR InstName L6
SYMATTR Value 20n
SYMBOL ind -1360 352 R180
WINDOW 0 36 80 Left 2
WINDOW 3 36 40 Left 2
SYMATTR InstName L7
SYMATTR Value 20n
SYMBOL ind -1808 48 R180
WINDOW 0 36 80 Left 2
WINDOW 3 36 40 Left 2
SYMATTR InstName L8
SYMATTR Value 20n
SYMBOL ind -2032 48 R180
WINDOW 0 36 80 Left 2
WINDOW 3 36 40 Left 2
SYMATTR InstName L9
SYMATTR Value 20n
SYMBOL ind -1808 352 R180
WINDOW 0 36 80 Left 2
WINDOW 3 36 40 Left 2
SYMATTR InstName L10
SYMATTR Value 20n
SYMBOL ind -2032 336 R180
WINDOW 0 36 80 Left 2
WINDOW 3 36 40 Left 2
SYMATTR InstName L11
SYMATTR Value 20n
SYMBOL ind -2176 128 R90
WINDOW 0 5 56 VBottom 2
WINDOW 3 32 56 VTop 2
SYMATTR InstName L12
SYMATTR Value 20n
SYMBOL ind -2992 128 R90
WINDOW 0 5 56 VBottom 2
WINDOW 3 32 56 VTop 2
SYMATTR InstName L13
SYMATTR Value 100n
SYMBOL ind -2032 576 R180
WINDOW 0 36 80 Left 2
WINDOW 3 36 40 Left 2
SYMATTR InstName L14
SYMATTR Value 20n
SYMBOL voltage -3200 1712 M0
WINDOW 123 24 124 Left 2
WINDOW 39 0 0 Left 0
SYMATTR Value2 AC 1m
SYMATTR InstName V1
SYMATTR Value ""
SYMBOL cap -2704 1664 R90
WINDOW 0 0 32 VBottom 2
WINDOW 3 32 32 VTop 2
SYMATTR InstName C10
SYMATTR Value 10µ
SYMBOL res -2816 1664 R90
WINDOW 0 0 56 VBottom 2
WINDOW 3 32 56 VTop 2
SYMATTR InstName R17
SYMATTR Value 50
SYMBOL res -2384 1728 R0
SYMATTR InstName R18
SYMATTR Value 50
SYMBOL npn -2112 1632 R0
SYMATTR InstName Q3
SYMATTR Value 2N4401
SYMBOL npn -1760 1632 M0
SYMATTR InstName Q5
SYMATTR Value 2N4401
SYMBOL diode -2528 1808 R0
SYMATTR InstName D11
SYMATTR Value 1N4148
SYMBOL diode -2528 1712 R0
SYMATTR InstName D12
SYMATTR Value 1N4148
SYMBOL diode -2592 1776 R180
WINDOW 0 24 64 Left 2
WINDOW 3 24 0 Left 2
SYMATTR InstName D13
SYMATTR Value 1N4148
SYMBOL diode -2592 1872 R180
WINDOW 0 24 64 Left 2
WINDOW 3 24 0 Left 2
SYMATTR InstName D14
SYMATTR Value 1N4148
SYMBOL res -560 1696 M270
WINDOW 0 32 56 VTop 2
WINDOW 3 0 56 VBottom 2
SYMATTR InstName R20
SYMATTR Value {R * 39}
SYMBOL res -720 1872 R0
SYMATTR InstName R21
SYMATTR Value {R}
SYMBOL ZZZ\\OpAmp\\AD8009an -512 1424 R0
SYMATTR InstName U1
SYMBOL cap -224 1520 R180
WINDOW 0 24 56 Left 2
WINDOW 3 24 8 Left 2
SYMATTR InstName C16
SYMATTR Value 20p
SYMBOL ind -848 1664 R90
WINDOW 0 5 56 VBottom 2
WINDOW 3 32 56 VTop 2
SYMATTR InstName L15
SYMATTR Value 20n
SYMBOL ind -848 1424 R90
WINDOW 0 5 56 VBottom 2
WINDOW 3 32 56 VTop 2
SYMATTR InstName L16
SYMATTR Value 20n
SYMBOL ind -656 1392 R90
WINDOW 0 5 56 VBottom 2
WINDOW 3 32 56 VTop 2
SYMATTR InstName L17
SYMATTR Value 20n
SYMBOL ind -384 1664 R90
WINDOW 0 5 56 VBottom 2
WINDOW 3 32 56 VTop 2
SYMATTR InstName L20
SYMATTR Value 20n
SYMBOL ind -688 1888 R180
WINDOW 0 36 80 Left 2
WINDOW 3 36 40 Left 2
SYMATTR InstName L21
SYMATTR Value 20n
SYMBOL ind -1808 1584 R180
WINDOW 0 36 80 Left 2
WINDOW 3 36 40 Left 2
SYMATTR InstName L22
SYMATTR Value 20n
SYMBOL ind -2032 1584 R180
WINDOW 0 36 80 Left 2
WINDOW 3 36 40 Left 2
SYMATTR InstName L23
SYMATTR Value 20n
SYMBOL ind -1808 1888 R180
WINDOW 0 36 80 Left 2
WINDOW 3 36 40 Left 2
SYMATTR InstName L24
SYMATTR Value 20n
SYMBOL ind -2032 1872 R180
WINDOW 0 36 80 Left 2
WINDOW 3 36 40 Left 2
SYMATTR InstName L25
SYMATTR Value 20n
SYMBOL ind -2176 1664 R90
WINDOW 0 5 56 VBottom 2
WINDOW 3 32 56 VTop 2
SYMATTR InstName L26
SYMATTR Value 20n
SYMBOL ind -2992 1664 R90
WINDOW 0 5 56 VBottom 2
WINDOW 3 32 56 VTop 2
SYMATTR InstName L27
SYMATTR Value 100n
SYMBOL ind -2032 2112 R180
WINDOW 0 36 80 Left 2
WINDOW 3 36 40 Left 2
SYMATTR InstName L28
SYMATTR Value 20n
SYMBOL current -2048 2240 R0
WINDOW 123 0 0 Left 0
WINDOW 39 0 0 Left 0
SYMATTR InstName I1
SYMATTR Value 10m
SYMBOL current -2048 1264 R0
WINDOW 123 0 0 Left 0
WINDOW 39 0 0 Left 0
SYMATTR InstName I2
SYMATTR Value 10m
SYMBOL current -1824 1264 R0
WINDOW 123 0 0 Left 0
WINDOW 39 0 0 Left 0
SYMATTR InstName I3
SYMATTR Value 10m
SYMBOL pnp -1568 1536 R180
SYMATTR InstName Q6
SYMATTR Value 2N5401_C
SYMBOL pnp -1328 1536 R180
SYMATTR InstName Q7
SYMATTR Value 2N5401_C
SYMBOL voltage -1200 1504 R0
SYMATTR InstName V10
SYMATTR Value 4V
SYMBOL npn -1568 1856 M0
SYMATTR InstName Q8
SYMATTR Value 2N4401
SYMBOL npn -1328 1856 M0
SYMATTR InstName Q11
SYMATTR Value 2N4401
SYMBOL OpAmps\\LT1001 -1056 1840 M0
SYMATTR InstName U4
SYMBOL res -1520 1760 R90
WINDOW 0 0 56 VBottom 2
WINDOW 3 32 56 VTop 2
SYMATTR InstName R14
SYMATTR Value 100k
SYMBOL res -1392 1760 R90
WINDOW 0 0 56 VBottom 2
WINDOW 3 32 56 VTop 2
SYMATTR InstName R15
SYMATTR Value 100k
SYMBOL voltage -880 1904 R0
WINDOW 123 0 0 Left 0
WINDOW 39 0 0 Left 0
SYMATTR InstName V11
SYMATTR Value 1
SYMBOL res -1168 1888 R90
WINDOW 0 0 56 VBottom 2
WINDOW 3 32 56 VTop 2
SYMATTR InstName R19
SYMATTR Value 1k
SYMBOL res -6384 224 R0
SYMATTR InstName R22
SYMATTR Value 510
SYMBOL voltage -6624 -240 M0
WINDOW 123 24 124 Left 2
WINDOW 39 0 0 Left 0
WINDOW 3 24 152 Left 2
SYMATTR Value 10
SYMATTR InstName V12
SYMBOL voltage -6608 240 M0
WINDOW 123 24 124 Left 2
WINDOW 39 0 0 Left 0
WINDOW 3 24 152 Left 2
SYMATTR Value 0
SYMATTR InstName V13
SYMBOL res -6240 -224 M0
SYMATTR InstName R7
SYMATTR Value {RC}
SYMBOL ind -5984 96 R90
WINDOW 0 5 56 VBottom 2
WINDOW 3 32 56 VTop 2
SYMATTR InstName L18
SYMATTR Value 100n
SYMBOL voltage -496 112 M0
WINDOW 123 24 124 Left 2
WINDOW 39 0 0 Left 0
SYMATTR Value2 AC 1m
SYMATTR InstName V14
SYMATTR Value ""
SYMBOL res 640 -336 R0
SYMATTR InstName R23
SYMATTR Value {rc}
SYMBOL res 896 -336 M0
SYMATTR InstName R24
SYMATTR Value {rc}
SYMBOL cap 0 64 R90
WINDOW 0 0 32 VBottom 2
WINDOW 3 32 32 VTop 2
SYMATTR InstName C11
SYMATTR Value 10µ
SYMBOL res -112 64 R90
WINDOW 0 0 56 VBottom 2
WINDOW 3 32 56 VTop 2
SYMATTR InstName R30
SYMATTR Value 50
SYMBOL res 320 128 R0
SYMATTR InstName R38
SYMATTR Value 50
SYMBOL npn 592 32 R0
SYMATTR InstName Q4
SYMATTR Value 2N4401
SYMBOL npn 944 32 M0
SYMATTR InstName Q14
SYMATTR Value 2N4401
SYMBOL diode 176 208 R0
SYMATTR InstName D7
SYMATTR Value 1N4148
SYMBOL diode 176 112 R0
SYMATTR InstName D8
SYMATTR Value 1N4148
SYMBOL diode 112 176 R180
WINDOW 0 24 64 Left 2
WINDOW 3 24 0 Left 2
SYMATTR InstName D15
SYMATTR Value 1N4148
SYMBOL diode 112 272 R180
WINDOW 0 24 64 Left 2
WINDOW 3 24 0 Left 2
SYMATTR InstName D16
SYMATTR Value 1N4148
SYMBOL res 1472 96 M270
WINDOW 0 32 56 VTop 2
WINDOW 3 0 56 VBottom 2
SYMATTR InstName R41
SYMATTR Value {R * 39}
SYMBOL res 1312 272 R0
SYMATTR InstName R42
SYMATTR Value {R}
SYMBOL ZZZ\\OpAmp\\AD8009an 1520 -176 R0
SYMATTR InstName U5
SYMBOL cap 1584 144 R90
WINDOW 0 0 32 VBottom 2
WINDOW 3 32 32 VTop 2
SYMATTR InstName C17
SYMATTR Value 5p
SYMBOL cap 1808 -80 R180
WINDOW 0 24 56 Left 2
WINDOW 3 24 8 Left 2
SYMATTR InstName C18
SYMATTR Value 20p
SYMBOL ind 1184 64 R90
WINDOW 0 5 56 VBottom 2
WINDOW 3 32 56 VTop 2
SYMATTR InstName L19
SYMATTR Value 20n
SYMBOL ind 1184 -176 R90
WINDOW 0 5 56 VBottom 2
WINDOW 3 32 56 VTop 2
SYMATTR InstName L29
SYMATTR Value 20n
SYMBOL ind 1376 -208 R90
WINDOW 0 5 56 VBottom 2
WINDOW 3 32 56 VTop 2
SYMATTR InstName L30
SYMATTR Value 20n
SYMBOL ind 1648 64 R90
WINDOW 0 5 56 VBottom 2
WINDOW 3 32 56 VTop 2
SYMATTR InstName L33
SYMATTR Value 20n
SYMBOL ind 1344 288 R180
WINDOW 0 36 80 Left 2
WINDOW 3 36 40 Left 2
SYMATTR InstName L34
SYMATTR Value 20n
SYMBOL ind 896 -16 R180
WINDOW 0 36 80 Left 2
WINDOW 3 36 40 Left 2
SYMATTR InstName L35
SYMATTR Value 20n
SYMBOL ind 672 -16 R180
WINDOW 0 36 80 Left 2
WINDOW 3 36 40 Left 2
SYMATTR InstName L36
SYMATTR Value 20n
SYMBOL ind 896 288 R180
WINDOW 0 36 80 Left 2
WINDOW 3 36 40 Left 2
SYMATTR InstName L37
SYMATTR Value 20n
SYMBOL ind 672 272 R180
WINDOW 0 36 80 Left 2
WINDOW 3 36 40 Left 2
SYMATTR InstName L38
SYMATTR Value 20n
SYMBOL ind 528 64 R90
WINDOW 0 5 56 VBottom 2
WINDOW 3 32 56 VTop 2
SYMATTR InstName L39
SYMATTR Value 20n
SYMBOL ind -288 64 R90
WINDOW 0 5 56 VBottom 2
WINDOW 3 32 56 VTop 2
SYMATTR InstName L40
SYMATTR Value 100n
SYMBOL ind 672 512 R180
WINDOW 0 36 80 Left 2
WINDOW 3 36 40 Left 2
SYMATTR InstName L41
SYMATTR Value 20n
SYMBOL current 656 640 R0
WINDOW 123 0 0 Left 0
WINDOW 39 0 0 Left 0
SYMATTR InstName I4
SYMATTR Value {current}
SYMBOL voltage 544 -352 M0
WINDOW 123 24 124 Left 2
WINDOW 39 0 0 Left 0
WINDOW 3 24 152 Left 2
SYMATTR Value {Vcc}
SYMATTR InstName V15
SYMBOL voltage 2144 32 M0
WINDOW 123 24 124 Left 2
WINDOW 39 0 0 Left 0
SYMATTR Value2 AC 1m
SYMATTR InstName V16
SYMATTR Value ""
SYMBOL res 3280 -416 R0
SYMATTR InstName R40
SYMATTR Value 100
SYMBOL cap 2640 -16 R90
WINDOW 0 0 32 VBottom 2
WINDOW 3 32 32 VTop 2
SYMATTR InstName C19
SYMATTR Value 10µ
SYMBOL res 2528 -16 R90
WINDOW 0 0 56 VBottom 2
WINDOW 3 32 56 VTop 2
SYMATTR InstName R43
SYMATTR Value 50
SYMBOL res 2960 48 R0
SYMATTR InstName R44
SYMATTR Value 50
SYMBOL npn 3232 -48 R0
SYMATTR InstName Q15
SYMATTR Value 2N4401
SYMBOL diode 2816 128 R0
SYMATTR InstName D21
SYMATTR Value 1N4148
SYMBOL diode 2816 32 R0
SYMATTR InstName D22
SYMATTR Value 1N4148
SYMBOL diode 2752 96 R180
WINDOW 0 24 64 Left 2
WINDOW 3 24 0 Left 2
SYMATTR InstName D27
SYMATTR Value 1N4148
SYMBOL diode 2752 192 R180
WINDOW 0 24 64 Left 2
WINDOW 3 24 0 Left 2
SYMATTR InstName D28
SYMATTR Value 1N4148
SYMBOL ind 3312 -96 R180
WINDOW 0 36 80 Left 2
WINDOW 3 36 40 Left 2
SYMATTR InstName L31
SYMATTR Value 20n
SYMBOL ind 3312 192 R180
WINDOW 0 36 80 Left 2
WINDOW 3 36 40 Left 2
SYMATTR InstName L32
SYMATTR Value 20n
SYMBOL ind 3168 -16 R90
WINDOW 0 5 56 VBottom 2
WINDOW 3 32 56 VTop 2
SYMATTR InstName L42
SYMATTR Value 1n
SYMBOL ind 2352 -16 R90
WINDOW 0 5 56 VBottom 2
WINDOW 3 32 56 VTop 2
SYMATTR InstName L43
SYMATTR Value 100n
SYMBOL voltage 3184 -432 M0
WINDOW 123 24 124 Left 2
WINDOW 39 0 0 Left 0
WINDOW 3 24 152 Left 2
SYMATTR Value 5
SYMATTR InstName V17
SYMBOL res 3472 512 R0
SYMATTR InstName R45
SYMATTR Value 5
SYMBOL cap 3504 448 R180
WINDOW 0 24 56 Left 2
WINDOW 3 24 8 Left 2
SYMATTR InstName C20
SYMATTR Value 10µ
SYMBOL res 3280 480 R0
SYMATTR InstName R46
SYMATTR Value 1k
SYMBOL voltage 3680 16 M0
WINDOW 123 24 124 Left 2
WINDOW 39 0 0 Left 0
SYMATTR Value2 AC 1m
SYMATTR InstName V18
SYMATTR Value ""
SYMBOL res 4816 -432 R0
SYMATTR InstName R47
SYMATTR Value 100
SYMBOL cap 4176 -32 R90
WINDOW 0 0 32 VBottom 2
WINDOW 3 32 32 VTop 2
SYMATTR InstName C21
SYMATTR Value 10µ
SYMBOL res 4064 -32 R90
WINDOW 0 0 56 VBottom 2
WINDOW 3 32 56 VTop 2
SYMATTR InstName R48
SYMATTR Value 50
SYMBOL res 4496 32 R0
SYMATTR InstName R49
SYMATTR Value 50
SYMBOL npn 4768 -64 R0
SYMATTR InstName Q16
SYMATTR Value 2N2369
SYMBOL diode 4352 112 R0
SYMATTR InstName D29
SYMATTR Value 1N4148
SYMBOL diode 4352 16 R0
SYMATTR InstName D30
SYMATTR Value 1N4148
SYMBOL diode 4288 80 R180
WINDOW 0 24 64 Left 2
WINDOW 3 24 0 Left 2
SYMATTR InstName D31
SYMATTR Value 1N4148
SYMBOL diode 4288 176 R180
WINDOW 0 24 64 Left 2
WINDOW 3 24 0 Left 2
SYMATTR InstName D32
SYMATTR Value 1N4148
SYMBOL ind 4848 -112 R180
WINDOW 0 36 80 Left 2
WINDOW 3 36 40 Left 2
SYMATTR InstName L44
SYMATTR Value 20n
SYMBOL ind 4848 176 R180
WINDOW 0 36 80 Left 2
WINDOW 3 36 40 Left 2
SYMATTR InstName L45
SYMATTR Value 20n
SYMBOL ind 4704 -32 R90
WINDOW 0 5 56 VBottom 2
WINDOW 3 32 56 VTop 2
SYMATTR InstName L46
SYMATTR Value 1n
SYMBOL ind 3888 -32 R90
WINDOW 0 5 56 VBottom 2
WINDOW 3 32 56 VTop 2
SYMATTR InstName L47
SYMATTR Value 100n
SYMBOL voltage 4720 -448 M0
WINDOW 123 24 124 Left 2
WINDOW 39 0 0 Left 0
WINDOW 3 24 152 Left 2
SYMATTR Value 5
SYMATTR InstName V19
SYMBOL res 5008 496 R0
SYMATTR InstName R50
SYMATTR Value 5
SYMBOL cap 5040 432 R180
WINDOW 0 24 56 Left 2
WINDOW 3 24 8 Left 2
SYMATTR InstName C22
SYMATTR Value 10µ
SYMBOL res 4816 464 R0
SYMATTR InstName R51
SYMATTR Value 1k
TEXT -6136 -376 Left 2 !.ac dec 100 1k 200Meg
TEXT -5912 232 Left 2 !.param R=11
TEXT -6136 -424 Left 2 !.param gm = 5m / 25m
TEXT -5568 -784 Left 2 !.param Trim = 100
TEXT -5888 -120 Left 2 ;200x
TEXT -6592 8 Left 2 ;0.5x
TEXT -5696 1368 Left 2 !.param Ccb=1p
TEXT -5696 1392 Left 2 !.param Ceb=3p
TEXT -1120 -168 Left 2 ;200x
TEXT -2160 120 Left 2 ;0.5x
TEXT -6480 -1256 Left 2 ;0.5x
TEXT -448 1368 Left 2 ;200x
TEXT -2160 1656 Left 2 ;0.5x
TEXT 1584 -232 Left 2 ;200x
TEXT 544 56 Left 2 ;0.5x
TEXT 832 -496 Left 2 !.param Vset = 3
TEXT 824 -472 Left 2 !.param rc = 4000
TEXT 1064 -440 Left 2 !.param Vcc = Vset + current/2*rc
TEXT 832 -528 Left 2 !.param current=10mA
TEXT 3184 -24 Left 2 ;0.5x
TEXT 4720 -40 Left 2 ;0.5x

The netlist it stands for:
* 202_bandwidth_sim.asc
R1 N096 input_2 {R * 39}
R2 input_2 0 {R}
C1 N096 input_2 5p
C2 input_2 0 {Ceb}
B1 N095 0 V=(V(coll_2) - V(coll_1)) * 3200
R3 buff N095 1k
C3 buff 0 3.3n
B2 N096 0 V=V(buff)
B3 coll_1 0 I=V(in+) * gm
R4 0 coll_1 2k
V2 N105 0 AC 1m
B4 coll_2 0 I=V(input_2) * gm
R5 0 coll_2 2k
R6 in+ 0 1k
C6 input_2 coll_2 {Ccb}
V3 12V 0 12
V4 -15V 0 -15
V5 N042 0 AC 1m
R8 N016 N027 {RC}
C7 N044 N043 10µ
R9 N043 N042 50
R10 N044 N082 50
C8 N028 N060 11p
Q1 N027 N044 N065 0 2N4401
Q2 N030 N045 N065 0 2N4401
V6 -5V 0 -5
V7 5V 0 5
D1 N075 0 1N4148
D2 N044 N075 1N4148
D3 N074 N044 1N4148
D4 0 N074 1N4148
XU3 N030 N027 5V -5V N028 AD8039  ; pins In+ In- V+ V- OUT
C9 in+ N106 10µ
R11 in+ 0 50
R12 N106 N105 50
C4 coll_1 in+ {Ccb}
C5 in+ 0 {Ceb}
D5 N110 0 1N4148
D6 in+ N110 1N4148
D9 N109 in+ 1N4148
D10 0 N109 1N4148
R13 N028 N045 {R * 39}
R16 N045 0 {R}
V8 N066 0 AC 1m
R25 N014 N023 1.5k
R26 N015 N025 1.5k
C12 N069 N068 10µ
R27 N068 N067 50
R28 N069 0 50
Q9 N057 N070 N080 0 2N4401
Q10 N058 N071 N083 0 2N4401
D17 N086 0 1N4148
D18 N069 N086 1N4148
D19 N085 N069 1N4148
D20 0 N085 1N4148
R29 N094 -5V 330
R31 N073 N072 {R * 39}
R32 N089 0 {R}
* U2: AD8009an (symbol ZZZ\OpAmp\AD8009an not available, pins judged from their places): In+=N026 In-=N024 V+=5V V-=-5V OUT=output
C13 output N072 5p
C15 0 output 20p
V9 N002 0 AC 1m
R34 12V N001 100
C14 N004 N003 10µ
R35 N003 N002 50
R36 N004 0 50
Q12 12V N004 N005 0 BC549C
Q13 N001 0 N006 0 BC549C
D23 N008 0 1N4148
D24 N004 N008 1N4148
D25 N007 N004 1N4148
D26 0 N007 1N4148
R37 N009 -5V 100
R33 N005 N009 10
R39 N006 N009 10
L1 N072 N071 20n
L2 N026 N025 20n
L3 N024 N023 20n
L4 12V N014 20n
L5 N015 12V 20n
L6 output N073 20n
L7 N089 N072 20n
L8 N058 N025 20n
L9 N057 N023 20n
L10 N090 N083 20n
L11 N090 N080 20n
L12 N070 N069 20n
L13 N067 N066 100n
L14 N094 N090 20n
V1 N111 0 AC 1m
C10 N114 N113 10µ
R17 N113 N112 50
R18 N114 0 50
Q3 N107 N115 N120 0 2N4401
Q5 N108 N116 N121 0 2N4401
D11 N123 0 1N4148
D12 N114 N123 1N4148
D13 N122 N114 1N4148
D14 0 N122 1N4148
R20 N118 N117 {R * 39}
R21 N125 0 {R}
* U1: AD8009an (symbol ZZZ\OpAmp\AD8009an not available, pins judged from their places): In+=N103 In-=N099 V+=5V V-=-5V OUT=N100
C16 0 N100 20p
L15 N117 N116 20n
L16 N103 N102 20n
L17 N099 N098 20n
L20 N100 N118 20n
L21 N125 N117 20n
L22 N108 N101 20n
L23 N107 N097 20n
L24 N128 N121 20n
L25 N128 N120 20n
L26 N115 N114 20n
L27 N112 N111 100n
L28 N129 N128 20n
I1 N129 -5V 10m
I2 12V N097 10m
I3 12V N101 10m
Q6 N102 N104 N101 0 2N5401_C
Q7 N098 N104 N097 0 2N5401_C
V10 N104 0 4V
Q8 N102 N126 -5V 0 2N4401
Q11 N098 N126 -5V 0 2N4401
XU4 N119 N124 12V -15V N127 LT1001  ; pins In+ In- V+ V- OUT
R14 N119 N102 100k
R15 N098 N119 100k
V11 N124 0 1
R19 N127 N126 1k
R22 N065 -5V 510
V12 N016 0 10
V13 N082 0 0
R7 N016 N030 {RC}
L18 N060 N045 100n
V14 N048 0 AC 1m
R23 N013 N018 {rc}
R24 N013 N021 {rc}
C11 N051 N050 10µ
R30 N050 N049 50
R38 N051 0 50
Q4 N046 N052 N076 0 2N4401
Q14 N047 N053 N077 0 2N4401
D7 N079 0 1N4148
D8 N051 N079 1N4148
D15 N078 N051 1N4148
D16 0 N078 1N4148
R41 N055 N054 {R * 39}
R42 N087 0 {R}
* U5: AD8009an (symbol ZZZ\OpAmp\AD8009an not available, pins judged from their places): In+=N022 In-=N019 V+=5V V-=-5V OUT=output
C17 output N054 5p
C18 0 output 20p
L19 N054 N053 20n
L29 N022 N021 20n
L30 N019 N018 20n
L33 output N055 20n
L34 N087 N054 20n
L35 N047 N021 20n
L36 N046 N018 20n
L37 N088 N077 20n
L38 N088 N076 20n
L39 N052 N051 20n
L40 N049 N048 100n
L41 N093 N088 20n
I4 N093 -5V {current}
V15 N013 0 {Vcc}
V16 N037 0 AC 1m
R40 N012 N020 100
C19 N040 N039 10µ
R43 N039 N038 50
R44 N040 0 50
Q15 N031 N041 N059 0 2N4401
D21 N064 0 1N4148
D22 N040 N064 1N4148
D27 N063 N040 1N4148
D28 0 N063 1N4148
L31 N031 N020 20n
L32 N084 N059 20n
L42 N041 N040 1n
L43 N038 N037 100n
V17 N012 0 5
R45 N092 -5V 5
C20 N092 N084 10µ
R46 N084 -5V 1k
V18 N032 0 AC 1m
R47 N011 N017 100
C21 N035 N034 10µ
R48 N034 N033 50
R49 N035 0 50
Q16 N029 N036 N056 0 2N2369
D29 N062 0 1N4148
D30 N035 N062 1N4148
D31 N061 N035 1N4148
D32 0 N061 1N4148
L44 N029 N017 20n
L45 N081 N056 20n
L46 N036 N035 1n
L47 N033 N032 100n
V19 N011 0 5
R50 N091 -5V 5
C22 N091 N081 10µ
R51 N081 -5V 1k
.model D D
.lib standard.dio
.model NPN NPN
.model PNP PNP
.lib standard.bjt
.ac dec 100 1k 200Meg
.param R=11
.param gm = 5m / 25m
.param Trim = 100
* 200x
* 0.5x
.param Ccb=1p
.param Ceb=3p
* 200x
* 0.5x
* 0.5x
* 200x
* 0.5x
* 200x
* 0.5x
.param Vset = 3
.param rc = 4000
.param Vcc = Vset + current/2*rc
.param current=10mA
* 0.5x
* 0.5x
.lib LTC.lib
.backanno
.end